# EAGLE design untitled (EAGLE 9.6.2)
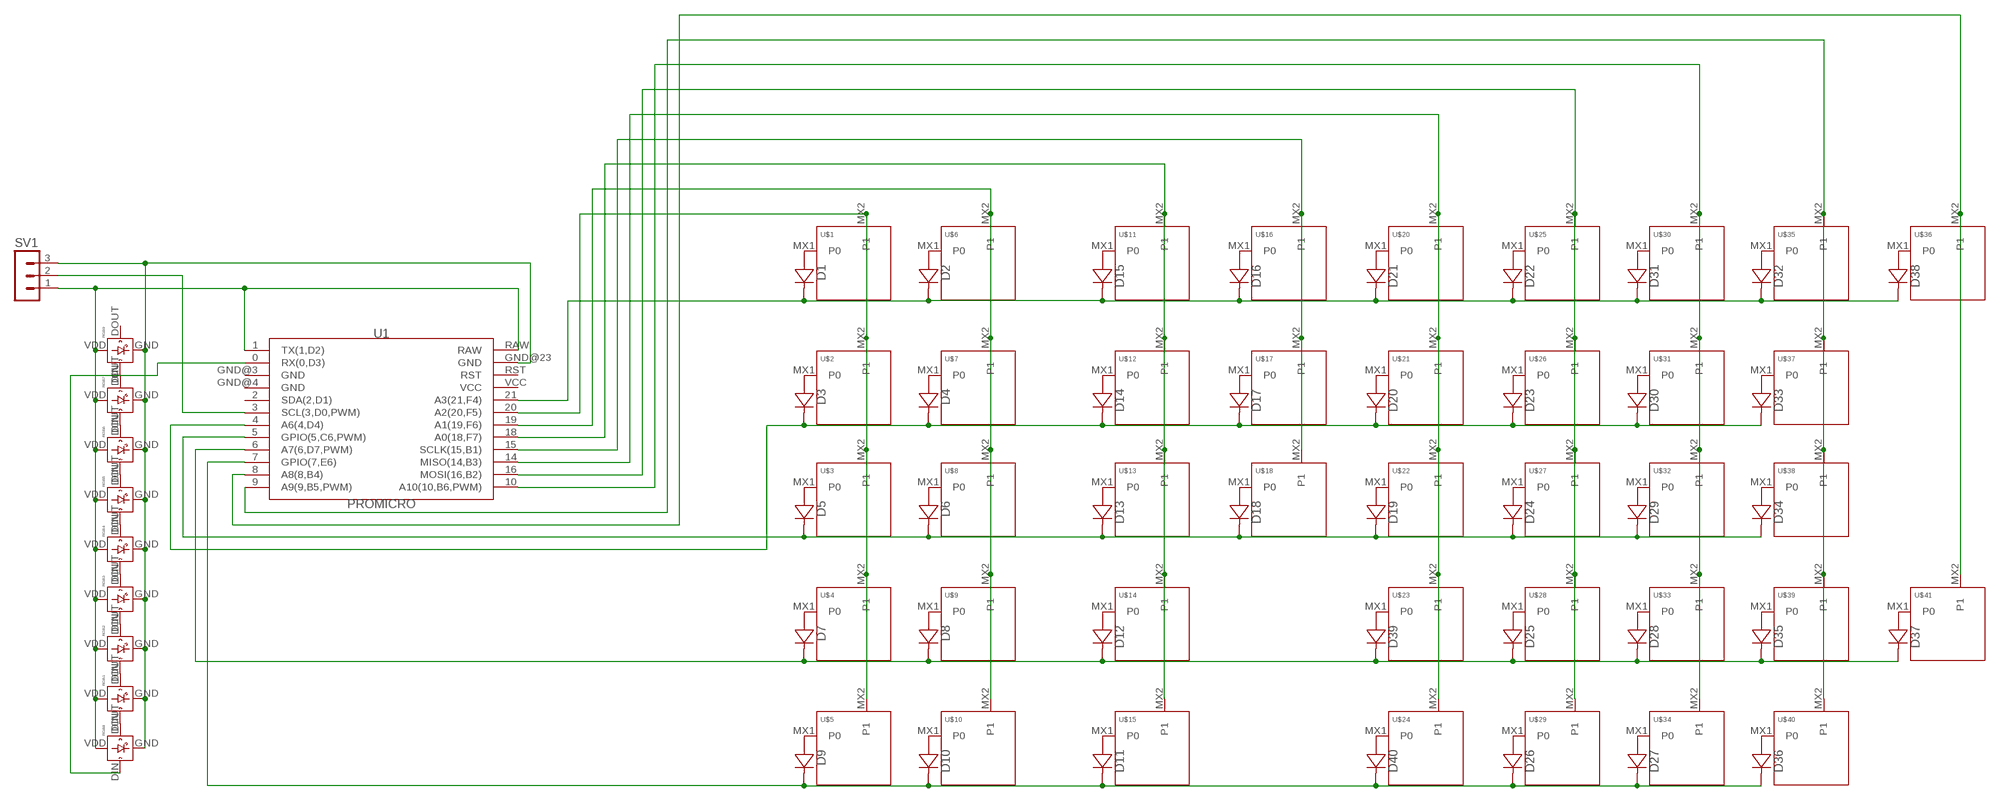
[diagram p0: schematic, sheet 1]

## Parts
D1  DIODE-SOD-123  [SOD-123]
D2  DIODE-SOD-123  [SOD-123]
D3  DIODE-SOD-123  [SOD-123]
D4  DIODE-SOD-123  [SOD-123]
D5  DIODE-SOD-123  [SOD-123]
D6  DIODE-SOD-123  [SOD-123]
D7  DIODE-SOD-123  [SOD-123]
D8  DIODE-SOD-123  [SOD-123]
D9  DIODE-SOD-123  [SOD-123]
D10  DIODE-SOD-123  [SOD-123]
D11  DIODE-SOD-123  [SOD-123]
D12  DIODE-SOD-123  [SOD-123]
D13  DIODE-SOD-123  [SOD-123]
D14  DIODE-SOD-123  [SOD-123]
D15  DIODE-SOD-123  [SOD-123]
D16  DIODE-SOD-123  [SOD-123]
D17  DIODE-SOD-123  [SOD-123]
D18  DIODE-SOD-123  [SOD-123]
D19  DIODE-SOD-123  [SOD-123]
D20  DIODE-SOD-123  [SOD-123]
D21  DIODE-SOD-123  [SOD-123]
D22  DIODE-SOD-123  [SOD-123]
D23  DIODE-SOD-123  [SOD-123]
D24  DIODE-SOD-123  [SOD-123]
D25  DIODE-SOD-123  [SOD-123]
D26  DIODE-SOD-123  [SOD-123]
D27  DIODE-SOD-123  [SOD-123]
D28  DIODE-SOD-123  [SOD-123]
D29  DIODE-SOD-123  [SOD-123]
D30  DIODE-SOD-123  [SOD-123]
D31  DIODE-SOD-123  [SOD-123]
D32  DIODE-SOD-123  [SOD-123]
D33  DIODE-SOD-123  [SOD-123]
D34  DIODE-SOD-123  [SOD-123]
D35  DIODE-SOD-123  [SOD-123]
D36  DIODE-SOD-123  [SOD-123]
D37  DIODE-SOD-123  [SOD-123]
D38  DIODE-SOD-123  [SOD-123]
D39  DIODE-SOD-123  [SOD-123]
D40  DIODE-SOD-123  [SOD-123]
RGB1  WS2812B-MINI  [WS2812B-MINI]
RGB2  WS2812B-MINI  [WS2812B-MINI]
RGB3  WS2812B-MINI  [WS2812B-MINI]
RGB4  WS2812B-MINI  [WS2812B-MINI]
RGB5  WS2812B-MINI  [WS2812B-MINI]
RGB6  WS2812B-MINI  [WS2812B-MINI]
RGB7  WS2812B-MINI  [WS2812B-MINI]
RGB8  WS2812B-MINI  [WS2812B-MINI]
RGB9  WS2812B-MINI  [WS2812B-MINI]
SV1  MA03-1  [MA03-1]
U1  PROMICRO  [PROMICRO]
U$1  KEYSWITCH-PLAIN-MX-1U  [MX-1U]
U$2  KEYSWITCH-PLAIN-MX-1U  [MX-1U]
U$3  KEYSWITCH-PLAIN-MX-1U  [MX-1U]
U$4  KEYSWITCH-PLAIN-MX-1U  [MX-1U]
U$5  KEYSWITCH-PLAIN-MX-1U  [MX-1U]
U$6  KEYSWITCH-PLAIN-MX-1U  [MX-1U]
U$7  KEYSWITCH-PLAIN-MX-1U  [MX-1U]
U$8  KEYSWITCH-PLAIN-MX-1U  [MX-1U]
U$9  KEYSWITCH-PLAIN-MX-1U  [MX-1U]
U$10  KEYSWITCH-PLAIN-MX-1U  [MX-1U]
U$11  KEYSWITCH-PLAIN-MX-1U  [MX-1U]
U$12  KEYSWITCH-PLAIN-MX-1U  [MX-1U]
U$13  KEYSWITCH-PLAIN-MX-1U  [MX-1U]
U$14  KEYSWITCH-PLAIN-MX-1U  [MX-1U]
U$15  KEYSWITCH-PLAIN-MX-1U  [MX-1U]
U$16  KEYSWITCH-PLAIN-MX-1U  [MX-1U]
U$17  KEYSWITCH-PLAIN-MX-1U  [MX-1U]
U$18  KEYSWITCH-PLAIN-MX-1U  [MX-1U]
U$20  KEYSWITCH-PLAIN-MX-1U  [MX-1U]
U$21  KEYSWITCH-PLAIN-MX-1U  [MX-1U]
U$22  KEYSWITCH-PLAIN-MX-1U  [MX-1U]
U$23  KEYSWITCH-PLAIN-MX-1U  [MX-1U]
U$24  KEYSWITCH-PLAIN-MX-1U  [MX-1U]
U$25  KEYSWITCH-PLAIN-MX-1U  [MX-1U]
U$26  KEYSWITCH-PLAIN-MX-1U  [MX-1U]
U$27  KEYSWITCH-PLAIN-MX-1U  [MX-1U]
U$28  KEYSWITCH-PLAIN-MX-1U  [MX-1U]
U$29  KEYSWITCH-PLAIN-MX-1U  [MX-1U]
U$30  KEYSWITCH-PLAIN-MX-1U  [MX-1U]
U$31  KEYSWITCH-PLAIN-MX-1U  [MX-1U]
U$32  KEYSWITCH-PLAIN-MX-1U  [MX-1U]
U$33  KEYSWITCH-PLAIN-MX-1U  [MX-1U]
U$34  KEYSWITCH-PLAIN-MX-1U  [MX-1U]
U$35  KEYSWITCH-PLAIN-MX-1U  [MX-1U]
U$36  KEYSWITCH-PLAIN-MX-1U  [MX-1U]
U$37  KEYSWITCH-PLAIN-MX-1U  [MX-1U]
U$38  KEYSWITCH-PLAIN-MX-1U  [MX-1U]
U$39  KEYSWITCH-PLAIN-MX-1U  [MX-1U]
U$40  KEYSWITCH-PLAIN-MX-1U  [MX-1U]
U$41  KEYSWITCH-PLAIN-MX-1U  [MX-1U]

## Nets
N$1: D1.A U$1.MX1(P0)
N$2: D2.A U$6.MX1(P0)
N$3: D3.A U$2.MX1(P0)
N$4: D4.A U$7.MX1(P0)
N$5: D5.A U$3.MX1(P0)
N$6: D6.A U$8.MX1(P0)
N$7: D7.A U$4.MX1(P0)
N$8: D8.A U$9.MX1(P0)
N$9: D9.A U$5.MX1(P0)
N$10: D10.A U$10.MX1(P0)
N$11: D11.A U$15.MX1(P0)
N$12: D12.A U$14.MX1(P0)
N$13: D13.A U$13.MX1(P0)
N$14: D14.A U$12.MX1(P0)
N$15: D15.A U$11.MX1(P0)
N$16: D16.A U$16.MX1(P0)
N$17: D17.A U$17.MX1(P0)
N$18: D18.A U$18.MX1(P0)
N$19: D19.A U$22.MX1(P0)
N$20: D20.A U$21.MX1(P0)
N$21: D21.A U$20.MX1(P0)
N$22: D22.A U$25.MX1(P0)
N$23: D23.A U$26.MX1(P0)
N$24: D24.A U$27.MX1(P0)
N$25: D25.A U$28.MX1(P0)
N$26: D26.A U$29.MX1(P0)
N$27: D27.A U$34.MX1(P0)
N$28: D28.A U$33.MX1(P0)
N$29: D29.A U$32.MX1(P0)
N$30: D30.A U$31.MX1(P0)
N$31: D31.A U$30.MX1(P0)
N$32: D32.A U$35.MX1(P0)
N$33: D33.A U$37.MX1(P0)
N$34: D34.A U$38.MX1(P0)
N$35: D35.A U$39.MX1(P0)
N$36: D36.A U$40.MX1(P0)
N$37: D37.A U$41.MX1(P0)
N$38: D38.A U$36.MX1(P0)
N$39: D1.C D2.C D15.C D16.C D21.C D22.C D31.C D32.C D38.C U1.21(A3(21,F4))
N$41: D5.C D6.C D13.C D18.C D19.C D24.C D29.C D34.C U1.5(GPIO(5,C6,PWM))
N$42: D7.C D8.C D12.C D25.C D28.C D35.C D37.C D39.C U1.6(A7(6,D7,PWM))
N$43: D39.A U$23.MX1(P0)
N$44: D40.A U$24.MX1(P0)
N$45: D9.C D10.C D11.C D26.C D27.C D36.C D40.C U1.7(GPIO(7,E6))
N$46: U1.20(A2(20,F5)) U$1.MX2(P1) U$2.MX2(P1) U$3.MX2(P1) U$4.MX2(P1) U$5.MX2(P1)
N$47: U1.19(A1(19,F6)) U$6.MX2(P1) U$7.MX2(P1) U$8.MX2(P1) U$9.MX2(P1) U$10.MX2(P1)
N$48: U1.18(A0(18,F7)) U$11.MX2(P1) U$12.MX2(P1) U$13.MX2(P1) U$14.MX2(P1) U$15.MX2(P1)
N$49: U1.15(SCLK(15,B1)) U$16.MX2(P1) U$17.MX2(P1) U$18.MX2(P1)
N$50: U1.14(MISO(14,B3)) U$20.MX2(P1) U$21.MX2(P1) U$22.MX2(P1) U$23.MX2(P1) U$24.MX2(P1)
N$51: U1.16(MOSI(16,B2)) U$25.MX2(P1) U$26.MX2(P1) U$27.MX2(P1) U$28.MX2(P1) U$29.MX2(P1)
N$52: U1.10(A10(10,B6,PWM)) U$30.MX2(P1) U$31.MX2(P1) U$32.MX2(P1) U$33.MX2(P1) U$34.MX2(P1)
N$53: U1.9(A9(9,B5,PWM)) U$35.MX2(P1) U$37.MX2(P1) U$38.MX2(P1) U$39.MX2(P1) U$40.MX2(P1)
N$54: U1.8(A8(8,B4)) U$36.MX2(P1) U$41.MX2(P1)
N$55: RGB1.DOUT RGB2.DIN
N$56: RGB2.DOUT RGB3.DIN
N$57: RGB3.DOUT RGB4.DIN
N$58: RGB4.DOUT RGB5.DIN
N$59: RGB5.DOUT RGB6.DIN
N$60: RGB6.DOUT RGB7.DIN
N$61: RGB1.DIN RGB8.DOUT
N$62: RGB7.DOUT RGB9.DIN
N$63: RGB1.VDD RGB2.VDD RGB3.VDD RGB4.VDD RGB5.VDD RGB6.VDD RGB7.VDD RGB8.VDD RGB9.VDD SV1.1 U1.1(TX(1,D2)) U1.RAW
N$64: RGB1.GND RGB2.GND RGB3.GND RGB4.GND RGB5.GND RGB6.GND RGB7.GND RGB8.GND RGB9.GND SV1.3 U1.GND@23(GND)
N$65: RGB8.DIN U1.0(RX(0,D3))
N$66: D3.C D4.C D14.C D17.C D20.C D23.C D30.C D33.C U1.4(A6(4,D4))
N$67: SV1.2 U1.3(SCL(3,D0,PWM))
Unconnected: RGB9.DOUT U1.2(SDA(2,D1)) U1.GND@3(GND) U1.GND@4(GND) U1.RST U1.VCC

## Library data of the parts
D1-D40 = Controller:DIODE: Standard 1N4148 diode
RGB1-RGB9 = LED:WS2812B
SV1 = con-lstb:MA03-1: PIN HEADER; OC_FARNELL: unknown; OC_NEWARK: unknown
U1 = Controller:PROMICRO
U$1-U$18 U$20-U$41 = Keyboard:KEYSWITCH-PLAIN

## Board
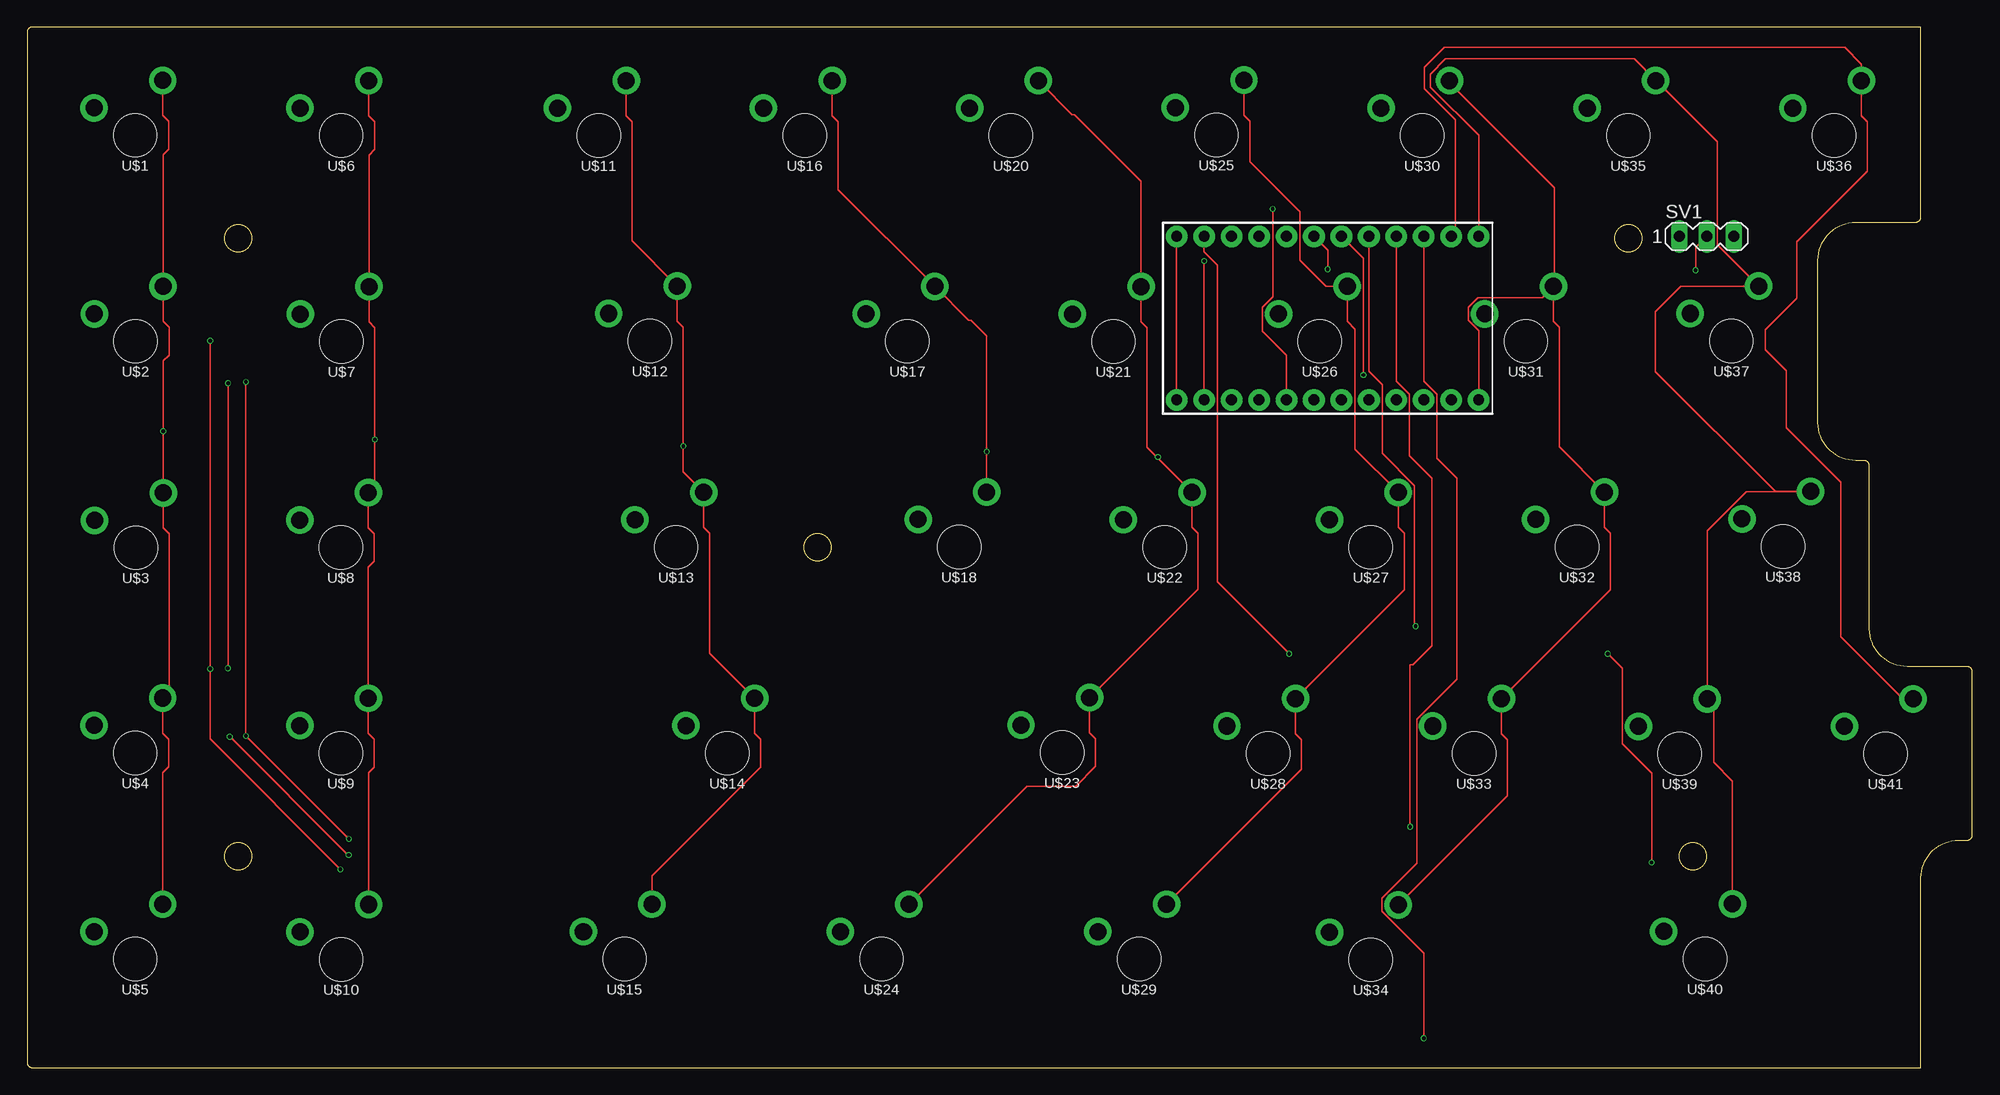
[diagram p1: board, top side]
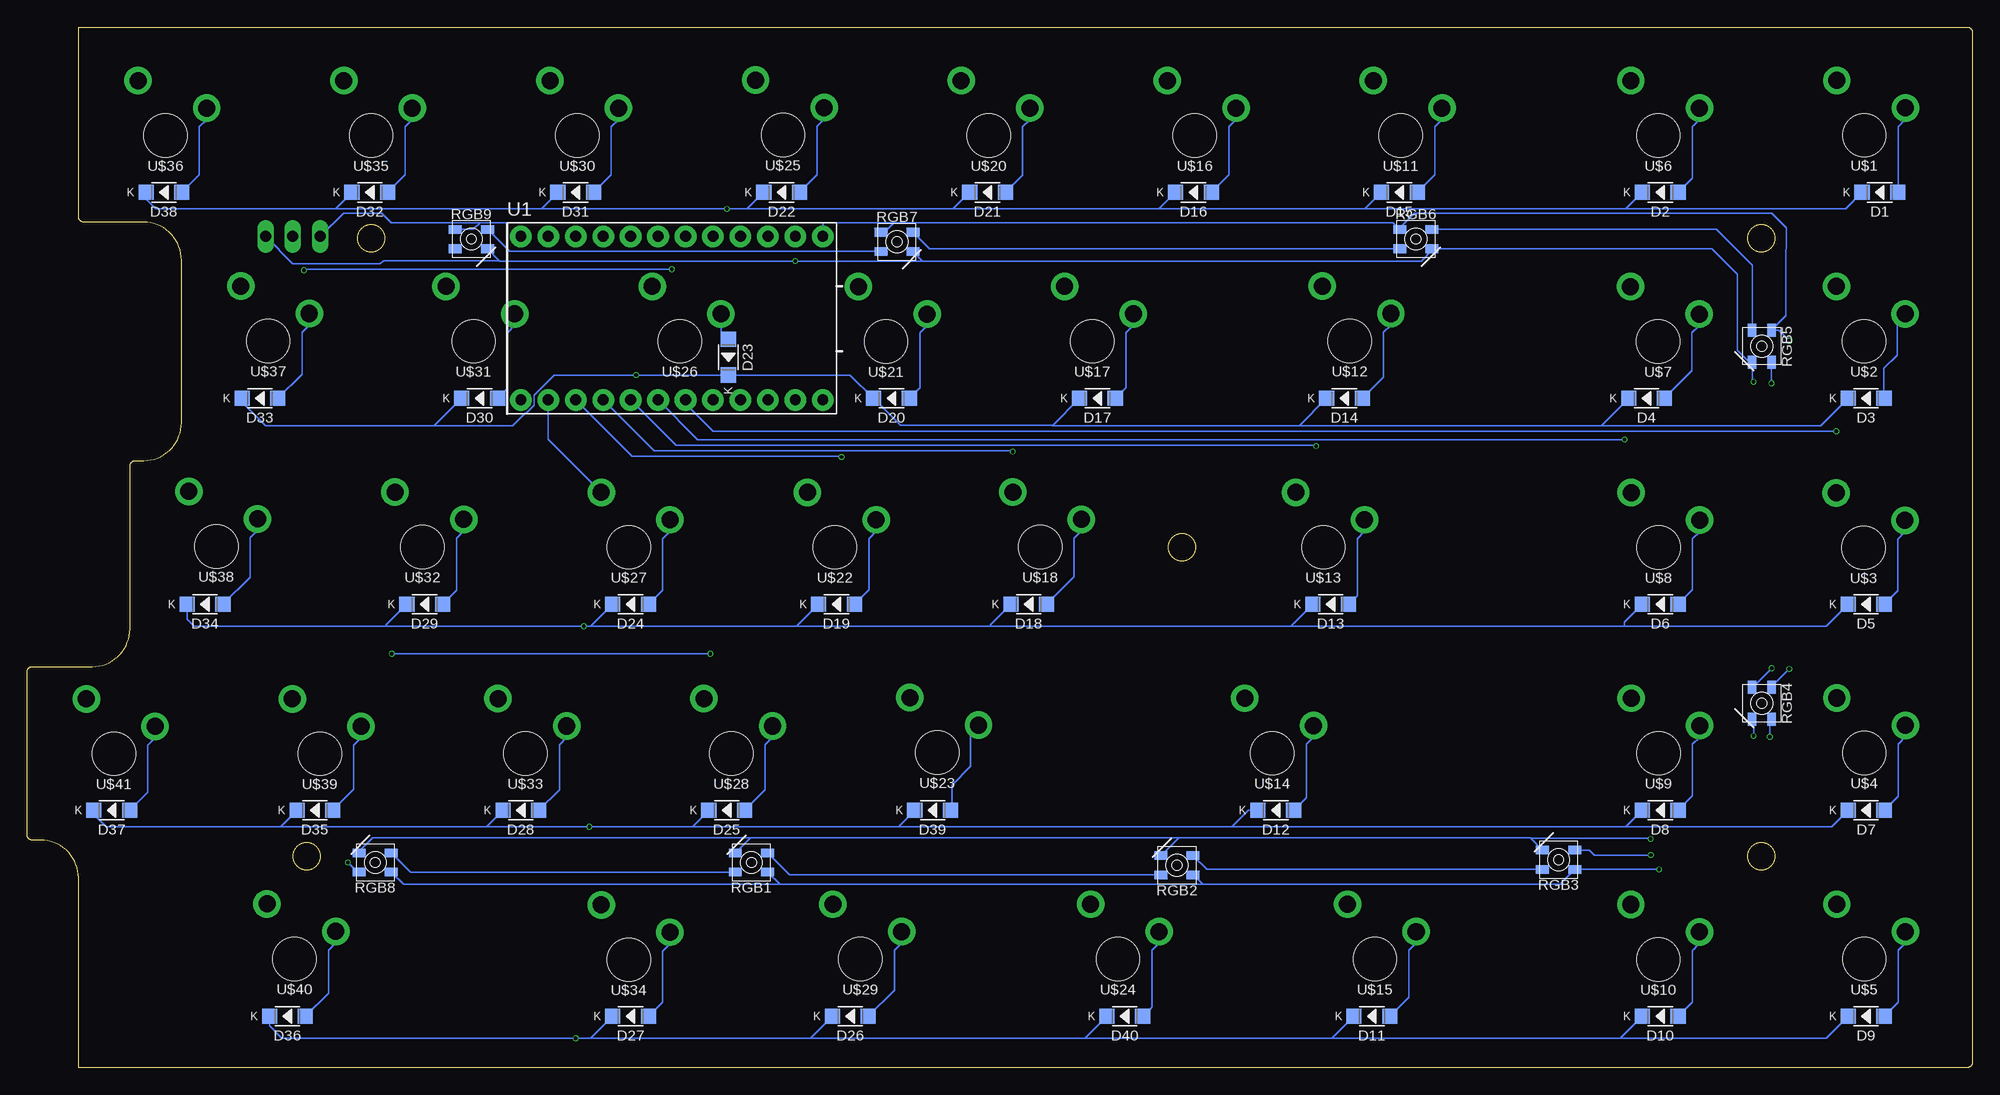
[diagram p2: board, bottom side, seen from below]

Size 179.98 x 96.25 mm. Coordinates in mm from the lower left corner, seen from the top.
Outline: 175.21,17.55 arc-90 178.71,21.05 179.48,21.05 arc90 179.98,21.55 179.98,36.6 arc90 179.48,37.1 173.95,37.1 arc-90 170.45,40.6 170.45,55.65 arc90 169.95,56.15 169.19,56.15 arc-90 165.69,59.65 165.69,74.7 arc-90 169.19,78.2 174.71,78.2 arc90 175.21,78.7 175.21,96.25 0.53,96.25 0.46,96.25 0.43,96.24 0.38,96.23 0.34,96.22 0.31,96.21 0.27,96.19 0.24,96.18 0.21,96.15 0.17,96.13 0.15,96.1 0.12,96.08 0.1,96.04 0.07,96.01 0.06,95.98 0.04,95.94 0.03,95.91 0.02,95.87 0.01,95.83 0,95.79 0,95.72 0,0.53 0,0.46 0.01,0.42 0.02,0.38 0.03,0.34 0.04,0.31 0.06,0.27 0.07,0.24 0.1,0.2 0.12,0.17 0.15,0.15 0.17,0.12 0.21,0.1 0.24,0.07 0.27,0.05 0.31,0.04 0.35,0.02 0.38,0.01 0.42,0.01 0.46,0 0.53,0 175.21,0 175.21,17.55
Outline: circle at 154.09,19.55 radius 1.25
Outline: circle at 148.14,76.7 radius 1.25
Outline: circle at 73.13,48.12 radius 1.25
Outline: circle at 19.55,19.55 radius 1.25
Outline: circle at 19.55,76.7 radius 1.25
Copper layers (1*16): Top 0.035559375mm / dielectric 1.6mm / Bottom 0.035559375mm
Design rules "jlcpcb2layer": minimum track width 5mil, minimum drill 12mil, track to track 5mil, track to pad 5mil, pad to pad 5mil, via to via 5mil, smd to smd 5mil, copper to edge 8mil, drill to drill 6mil, minimum pad ring 5mil, minimum via ring 3mil, stop-mask expansion 2.5mil, vias tented up to drill 0mil, thermal gap 10mil

### Footprints (pad centres in the part's own frame; a part is rotated, then mirrored left to right if it is on the bottom)
SOD-123 = smd 1.397 x 1.397: A -1.651,0; C 1.651,0
WS2812B-MINI = smd 0.8 x 1.2: DIN 0.89,-1.49; DOUT -0.89,1.49; GND -0.89,-1.49; VDD 0.89,1.49
MA03-1 = drill 1.016 long: 1 -2.54,0; 2 0,0; 3 2.54,0
PROMICRO = drill 1 pad 2: 0 -7.62,11.43; 1 -7.62,13.97; 2 -7.62,3.81; 3 -7.62,1.27; 4 -7.62,-1.27; 5 -7.62,-3.81; 6 -7.62,-6.35; 7 -7.62,-8.89; 8 -7.62,-11.43; 9 -7.62,-13.97; 10 7.5,-13.97; 14 7.5,-8.89; 15 7.5,-6.35; 16 7.5,-11.43; 18 7.5,-3.81; 19 7.5,-1.27; 20 7.5,1.27; 21 7.5,3.81; GND@3 -7.62,8.89; GND@4 -7.62,6.35; GND@23 7.5,11.43; RAW 7.5,13.97; RST 7.5,8.89; VCC 7.5,6.35
MX-1U = drill 1.575 pad 2.54: MX1 -3.81,2.54; MX2 2.54,5.08 | hole 4: 0,0

### Placement (x,y rotation side)
D1  8.57,80.96 180 bottom
D2  28.89,80.96 180 bottom
D3  9.84,61.91 180 bottom
D4  30.16,61.91 180 bottom
D5  9.84,42.86 180 bottom
D6  28.89,42.86 180 bottom
D7  9.84,23.81 180 bottom
D8  28.89,23.81 180 bottom
D9  9.84,4.76 180 bottom
D10  28.89,4.76 180 bottom
D11  55.56,4.76 180 bottom
D12  64.45,23.81 180 bottom
D13  59.37,42.86 180 bottom
D14  58.1,61.91 180 bottom
D15  53.02,80.96 180 bottom
D16  72.07,80.96 180 bottom
D17  80.96,61.91 180 bottom
D18  87.31,42.86 180 bottom
D19  105.09,42.86 180 bottom
D20  100.01,61.91 180 bottom
D21  91.12,80.96 180 bottom
D22  110.17,80.96 180 bottom
D23  115.09,65.72 270 bottom
D24  124.14,42.86 180 bottom
D25  115.25,23.81 180 bottom
D26  103.82,4.76 180 bottom
D27  124.14,4.76 180 bottom
D28  134.3,23.81 180 bottom
D29  143.19,42.86 180 bottom
D30  138.11,61.91 180 bottom
D31  129.22,80.96 180 bottom
D32  148.27,80.96 180 bottom
D33  158.43,61.91 180 bottom
D34  163.51,42.86 180 bottom
D35  153.35,23.81 180 bottom
D36  155.89,4.76 180 bottom
D37  172.14,23.81 180 bottom
D38  167.32,80.96 180 bottom
D39  96.2,23.81 180 bottom
D40  78.42,4.76 180 bottom
RGB1  112.96,18.98 270 bottom
RGB2  73.59,18.73 270 bottom
RGB3  38.28,19.23 270 bottom
RGB4  19.49,33.71 0 bottom
RGB5  19.49,66.73 0 bottom
RGB6  51.49,76.64 90 bottom
RGB7  99.5,76.38 90 bottom
RGB8  147.76,18.98 270 bottom
RGB9  138.87,76.64 90 bottom
SV1  155.38,76.89 0 top
U1  120.33,69.27 270 bottom
U$1  10.01,86.24 0 top
U$2  10.04,67.19 0 top
U$3  10.06,48.09 0 top
U$4  10.01,29.11 0 top
U$5  10.01,10.04 0 top
U$6  29.06,86.21 0 top
U$7  29.09,67.16 0 top
U$8  29.04,48.11 0 top
U$9  29.04,29.09 0 top
U$10  29.06,10.01 0 top
U$11  52.89,86.21 0 top
U$12  57.61,67.21 0 top
U$13  60.05,48.14 0 top
U$14  64.78,29.09 0 top
U$15  55.28,10.04 0 top
U$16  71.94,86.21 0 top
U$17  81.44,67.19 0 top
U$18  86.24,48.16 0 top
U$20  91.01,86.21 0 top
U$21  100.51,67.16 0 top
U$22  105.24,48.14 0 top
U$23  95.76,29.14 0 top
U$24  79.05,10.04 0 top
U$25  110.04,86.26 0 top
U$26  119.59,67.19 0 top
U$27  124.31,48.14 0 top
U$28  114.81,29.06 0 top
U$29  102.88,10.04 0 top
U$30  129.06,86.21 0 top
U$31  138.67,67.19 0 top
U$32  143.39,48.16 0 top
U$33  133.86,29.06 0 top
U$34  124.31,9.99 0 top
U$35  148.14,86.21 0 top
U$36  167.16,86.21 0 top
U$37  157.66,67.21 0 top
U$38  162.46,48.22 0 top
U$39  152.89,29.04 0 top
U$40  155.23,10.06 0 top
U$41  171.94,29.04 0 top

### Tracks (layer width: path | path; a pad name or v marks a point on that pad's centre or on a via)
N$1
  Bottom 0.152: U$1.MX1 6.2,87.72 6.88,87.04 6.88,81 D1.A
N$2
  Bottom 0.152: U$6.MX1 25.25,87.69 25.93,87.02 25.93,82.27 D2.A
N$3
  Bottom 0.152: D3.A 8.19,64.67 6.95,65.91 6.95,69.01 U$2.MX1
N$4
  Bottom 0.152: U$7.MX1 25.28,68.64 25.95,67.97 25.95,64.46 D4.A
N$5
  Bottom 0.152: U$3.MX1 6.26,49.57 6.93,48.89 6.93,44.11 D5.A
N$6
  Bottom 0.152: U$8.MX1 25.23,49.59 25.9,48.92 25.9,44.19 D6.A
N$7
  Bottom 0.152: U$4.MX1 6.2,30.59 6.88,29.92 6.88,25.12 D7.A
N$8
  Bottom 0.152: U$9.MX1 25.23,30.57 25.9,29.89 25.9,25.14 D8.A
N$9
  Bottom 0.152: U$5.MX1 6.2,11.52 6.88,10.84 6.88,6.07 D9.A
N$10
  Bottom 0.152: U$10.MX1 25.25,11.49 25.93,10.82 25.93,6.07 D10.A
N$11
  Bottom 0.152: U$15.MX1 51.47,11.52 52.14,10.84 52.14,6.52 D11.A
N$12
  Bottom 0.152: U$14.MX1 60.97,30.57 61.64,29.89 61.64,24.96 D12.A
N$13
  Bottom 0.152: U$13.MX1 56.24,49.62 56.91,48.94 56.91,43.66 D13.A
N$14
  Bottom 0.152: U$12.MX1 53.8,68.69 54.48,68.02 54.48,63.88 D14.A
N$15
  Bottom 0.152: U$11.MX1 49.08,87.69 49.75,87.02 49.75,82.57 D15.A
N$16
  Bottom 0.152: U$16.MX1 68.13,87.69 68.8,87.02 68.8,82.57 D16.A
N$17
  Bottom 0.152: U$17.MX1 77.63,68.67 78.3,67.99 78.3,62.91 D17.A
N$18
  Bottom 0.152: U$18.MX1 82.43,49.64 83.1,48.97 83.1,45.41 D18.A
N$19
  Bottom 0.152: U$22.MX1 101.43,49.62 102.1,48.94 102.1,44.19 D19.A
N$20
  Bottom 0.152: U$21.MX1 96.7,68.64 97.38,67.97 97.38,62.89 D20.A
N$21
  Bottom 0.152: U$20.MX1 87.2,87.69 87.88,87.02 87.88,82.54 D21.A
N$22
  Bottom 0.152: U$25.MX1 106.23,87.74 106.9,87.07 106.9,82.57 D22.A
N$23
  Bottom 0.152: U$26.MX1 115.78,68.05 D23.A
N$24
  Bottom 0.152: U$27.MX1 120.5,49.62 121.18,48.94 121.18,44.17 D24.A
N$25
  Bottom 0.152: U$28.MX1 111,30.54 111.68,29.87 111.68,25.73 D25.A
N$26
  Bottom 0.152: U$29.MX1 99.07,11.52 99.74,10.84 99.74,7.18 D26.A
N$27
  Bottom 0.152: U$34.MX1 120.5,11.47 121.18,10.79 121.18,6.07 D27.A
N$28
  Bottom 0.152: U$33.MX1 130.05,30.54 130.73,29.87 130.73,25.73 D28.A
N$29
  Bottom 0.152: U$32.MX1 139.58,49.64 140.25,48.97 140.25,44.14 D29.A
N$30
  Bottom 0.152: U$31.MX1 134.86,68.67 135.53,67.99 135.53,62.83 D30.A
N$31
  Bottom 0.152: U$30.MX1 125.25,87.69 125.93,87.02 125.93,82.6 D31.A
N$32
  Bottom 0.152: U$35.MX1 144.33,87.69 145,87.02 145,82.57 D32.A
N$33
  Bottom 0.152: U$37.MX1 153.85,68.69 154.53,68.02 154.53,64.16 D33.A
N$34
  Bottom 0.152: U$38.MX1 158.66,49.69 159.33,49.02 159.33,45.38 D34.A
N$35
  Bottom 0.152: U$39.MX1 149.08,30.52 149.75,29.84 149.75,25.75 D35.A
N$36
  Bottom 0.152: U$40.MX1 151.42,11.54 152.09,10.87 152.09,6.9 D36.A
N$37
  Bottom 0.152: U$41.MX1 168.13,30.52 168.8,29.84 168.8,25.5 D37.A
N$38
  Bottom 0.152: U$36.MX1 163.35,87.69 164.03,87.02 164.03,82.6 D38.A
N$39  (via drill 0.35)
  Top 0.152: U1.21 116.52,65.89 114.28,68.13 114.28,70.35 115.25,71.32 v115.25,79.43
  Bottom 0.152: D1.C 11.74,79.43 32.06,79.43 | 32.06,79.43 56.19,79.43 | 56.19,79.43 75.24,79.43 | 75.24,79.43 94.29,79.43 | 94.29,79.43 113.34,79.43 | 113.34,79.43 v115.25,79.43 132.39,79.43 | 132.39,79.43 151.44,79.43 | 151.44,79.43 168.08,79.43 168.97,80.32 D38.C | D2.C 32.06,79.43 | D15.C 56.19,79.43 | D16.C 75.24,79.43 | D21.C 94.29,79.43 | D22.C 113.34,79.43 | D31.C 132.39,79.43 | D32.C 151.44,79.43
N$41  (via drill 0.35)
  Top 0.152: U1.5 124.14,64.42 125.37,63.19 125.37,56.83 128.35,53.84 128.35,40.93 v128.45,40.82
  Bottom 0.152: D5.C 13.52,40.82 32.19,40.82 | 63.05,40.82 90.86,40.82 | 90.86,40.82 108.77,40.82 | 108.77,40.82 127.82,40.82 | 127.82,40.82 v128.45,40.82 146.74,40.82 | 146.74,40.82 164.52,40.82 165.16,41.46 D34.C | D6.C 32.19,41.21 32.19,40.82 | D13.C 63.05,40.82 | D18.C 90.86,40.95 90.86,40.82 | D19.C 108.77,40.82 | D24.C 127.82,40.82 | D29.C 146.74,40.95 146.74,40.82 | 32.19,40.82 63.05,40.82
N$42  (via drill 0.35)
  Top 0.152: U1.6 126.68,63.51 127.91,62.28 127.91,56.61 129.98,54.54 129.98,39.05 128.2,37.27 127.95,37.27 v127.95,22.28
  Bottom 0.152: D7.C 13.01,22.28 32.06,22.28 | 32.06,22.28 68.51,22.28 | 68.51,22.28 99.37,22.28 | 99.37,22.28 118.42,22.28 | 118.42,22.28 v127.95,22.28 137.47,22.28 | 137.47,22.28 156.52,22.28 | 156.52,22.28 172.65,22.28 173.79,23.43 D37.C | D35.C 156.52,22.28 | D28.C 137.47,22.28 | D25.C 118.42,22.28 | D39.C 99.37,22.28 | D12.C 66.99,23.81 68.51,22.28 | D8.C 32.06,22.28
N$43
  Bottom 0.152: U$23.MX1 92.67,30.96 92.67,27.86 94.42,26.11 94.42,23.3 94.55,23.43 D39.A
N$44
  Bottom 0.152: U$24.MX1 75.24,11.52 75.91,10.84 75.91,5.61 D40.A
N$45  (via drill 0.35)
  Top 0.152: U1.7 129.22,63.51 130.45,62.28 130.45,56.36 132.26,54.54 132.26,35.93 128.56,32.23 128.56,18.89 125.36,15.69 125.36,14.45 129.22,10.59 v129.22,2.72
  Bottom 0.152: D9.C 13.52,2.72 32.57,2.72 | 32.57,2.72 59.24,2.72 | 59.24,2.72 82.1,2.72 | 82.1,2.72 107.5,2.72 | 107.5,2.72 127.82,2.72 | D36.C 157.54,3.87 156.39,2.72 v129.22,2.72 127.82,2.72 | D10.C 32.57,2.72 | D11.C 59.24,2.72 | D40.C 82.1,2.72 | D26.C 107.5,2.72 | D27.C 127.82,2.72
N$46  (via drill 0.35)
  Top 0.152: U$1.MX2 12.55,88.07 13.11,87.52 13.11,84.96 12.58,84.43 U$2.MX2 12.58,69.02 13.13,68.47 13.13,65.91 12.61,65.38 v12.61,58.86 U$3.MX2 12.61,49.92 13.16,49.37 13.16,34.8 U$4.MX2 12.55,30.95 13.11,30.4 13.11,27.83 12.55,27.28 U$5.MX2
  Bottom 0.152: U1.20 119.06,61.4 116.52,58.86 v12.61,58.86
N$47  (via drill 0.35)
  Top 0.152: U$6.MX2 31.6,88.05 32.16,87.5 32.16,84.93 31.63,84.41 U$7.MX2 31.63,69 32.18,68.45 v32.18,58.1 32.18,53.8 U$8.MX2 31.58,49.95 32.13,49.4 32.13,46.83 31.58,46.28 U$9.MX2 31.58,30.92 32.13,30.37 32.13,27.81 31.6,27.28 U$10.MX2
  Bottom 0.152: U1.19 117.92,58.1 v32.18,58.1
N$48  (via drill 0.35)
  Top 0.152: U$11.MX2 55.43,88.05 55.98,87.5 55.98,76.47 U$12.MX2 60.15,69.05 60.71,68.5 v60.71,57.49 60.71,55.11 U$13.MX2 62.59,49.97 63.14,49.42 63.14,38.34 U$14.MX2 67.32,30.92 67.87,30.37 67.87,27.81 57.82,17.76 U$15.MX2
  Bottom 0.152: U1.18 119.95,57.59 60.64,57.59 60.64,57.56 v60.71,57.49
N$49  (via drill 0.35)
  Top 0.152: U$16.MX2 74.48,88.05 75.03,87.5 75.03,81.22 U$17.MX2 87.12,69.13 87.32,69.13 88.78,67.68 v88.78,56.98 U$18.MX2
  Bottom 0.152: U1.15 121.98,57.08 88.83,57.08 88.78,57.03 v88.78,56.98
N$50  (via drill 0.35)
  Top 0.152: U$20.MX2 96.69,88.16 96.9,88.16 103.05,82 U$21.MX2 103.05,69 103.61,68.45 103.61,57.39 104.63,56.37 | 104.63,56.37 U$22.MX2 107.78,49.97 108.33,49.42 108.33,44.25 U$23.MX2 98.3,30.97 98.86,30.42 98.86,27.86 97.05,26.05 92.52,26.05 U$24.MX2 | v104.63,56.47 104.63,56.37
  Bottom 0.152: U1.14 124.02,56.57 104.53,56.57 v104.63,56.47
N$51
  Top 0.152: U$25.MX2 112.58,88.1 113.13,87.55 113.13,83.79 117.75,79.18 117.75,74.67 120.15,72.27 U$26.MX2 122.13,69.02 122.86,68.29 122.86,57.21 U$27.MX2 126.85,49.97 127.41,49.42 127.41,44.2 U$28.MX2 117.35,30.9 117.91,30.35 117.91,27.61 U$29.MX2
  Bottom 0.152: U1.16 131.76,58.12 U$27.MX2
N$52
  Top 0.152: U$30.MX2 131.6,91.1 141.3,81.4 141.3,72.36 U$31.MX2 | U$31.MX2 141.21,69.02 141.76,68.47 141.76,57.42 U$32.MX2 145.93,50 146.48,49.45 146.48,44.22 U$33.MX2 136.4,30.9 136.96,30.35 136.96,25.17 U$34.MX2 | U$31.MX2 140.16,71.23 134.23,71.23 133.36,70.35 133.36,69.11 134.3,68.17 U1.10
N$53
  Top 0.152: U$40.MX2 157.77,26.5 156.03,28.23 156.03,33.52 U$39.MX2 155.44,34.13 155.44,49.66 159.05,53.27 164.98,53.27 U$38.MX2 161.73,53.3 150.64,64.38 150.64,69.93 152.98,72.27 160.18,72.27 U$37.MX2 156.37,76.13 156.37,85.66 150.73,91.29 U$35.MX2 148.67,93.3 131.24,93.3 129.83,91.89 129.83,90.7 134.3,86.23 U1.9
N$54
  Top 0.152: U$41.MX2 173.51,34.12 167.77,39.86 167.77,54.17 162.74,59.2 162.74,64.47 160.8,66.41 160.8,68.23 163.74,71.17 163.74,76.38 170.26,82.9 170.26,87.5 169.7,88.05 U$36.MX2 169.7,92.82 168.15,94.37 131.11,94.37 129.29,92.55 129.29,90.55 132.16,87.68 132.16,77.29 U1.8
N$55
  Bottom 0.152: RGB2.DIN 109.44,17.84 RGB1.DOUT
N$56
  Bottom 0.152: RGB3.DIN 70.83,18.34 RGB2.DOUT
N$57  (via drill 0.35)
  Top 0.152: v29.75,19.67 29.72,19.67 18.78,30.61 v18.75,30.61
  Bottom 0.152: RGB4.DIN 18.73,32.09 18.73,30.59 v18.75,30.61 | RGB3.DOUT 35.46,20.12 34.98,19.64 29.77,19.64 v29.75,19.67
N$58  (via drill 0.35)
  Top 0.152: v18.6,63.3 18.6,36.96 v18.58,36.94
  Bottom 0.152: RGB5.DIN 18.6,63.56 18.73,63.43 v18.6,63.3 | RGB4.DOUT 20.31,35.2 v18.58,36.94
N$59
  Bottom 0.152: RGB6.DIN 23.69,77.53 20.38,74.21 RGB5.DOUT
N$60
  Bottom 0.152: RGB6.DOUT 96.48,75.75 RGB7.DIN
N$61
  Bottom 0.152: RGB1.DIN 144.49,18.09 RGB8.DOUT
N$62
  Bottom 0.152: RGB7.DOUT 135.34,75.49 RGB9.DIN
N$63  (via drill 0.35)
  Top 0.152: v28.99,18.35 28.99,18.37 16.95,30.41 v16.95,36.89 v16.95,67.24 | U1.1 U1.RAW
  Bottom 0.152: 71.21,16.95 38.03,16.95 38.03,17.11 RGB3.VDD v28.99,18.35 | 71.21,16.95 110.33,16.95 | 110.33,16.95 145.13,16.95 RGB8.VDD | RGB1.VDD 110.33,16.95 | RGB2.VDD 71.21,16.95 | RGB9.VDD 138.7,77.53 138.07,78.16 | 106.36,78.16 138.07,78.16 | 106.36,78.16 99.75,78.16 | 99.75,78.16 54.04,78.16 54.03,78.16 53.62,78.16 53.57,78.12 53.06,77.61 | 53.06,77.61 RGB6.VDD | RGB7.VDD 100.64,77.27 99.75,78.16 | v16.95,36.89 18.6,35.24 RGB4.VDD | 53.06,77.61 51.63,79.04 18.58,79.04 17.21,77.67 17.21,75.73 17.28,75.66 17.28,69.54 RGB5.VDD 17.93,68.22 v16.95,67.24 | U1.1 106.36,78.16 | 138.07,78.16 146.27,78.16 147.16,79.04 150.69,79.04 SV1.1
N$64  (via drill 0.35)
  Top 0.152: v20.25,63.43 v20.25,30.69 v29.78,21.16 | U1.GND@23 v108.9,74.61
  Bottom 0.152: RGB3.GND 40.87,21.22 | 40.87,21.22 40.92,21.27 73.43,21.27 | 73.43,21.27 113.05,21.27 | 113.05,21.27 148.01,21.27 149.25,20.03 RGB8.GND | RGB1.GND 113.05,21.27 | RGB2.GND 73.43,21.27 | RGB9.GND 136.28,74.65 | 136.28,74.65 136.24,74.61 v108.9,74.61 97.12,74.61 | 97.12,74.61 50.98,74.61 50,75.59 RGB6.GND 24.12,75.75 21.75,73.37 21.75,66.36 20.63,65.24 RGB5.GND 20.38,63.56 v20.25,63.43 | RGB7.GND 97.12,74.61 | v20.25,30.69 20.25,32.09 RGB4.GND | v29.78,21.16 29.83,21.22 40.87,21.22 | 136.28,74.65 147,74.65 147.29,74.36 155.38,74.36 SV1.3
N$65  (via drill 0.35)
  Top 0.152: U1.0 108.9,75.46 110.13,74.24 110.13,44.93 v116.77,38.28 | v150.3,18.98 150.3,27.26 147.58,29.97 147.58,36.94 v146.23,38.28
  Bottom 0.152: v116.77,38.28 v146.23,38.28 | v150.3,18.98 149.41,18.09 RGB8.DIN
N$66  (via drill 0.35)
  Top 0.152: U1.4 123.63,74.86 v123.63,64.07
  Bottom 0.152: D3.C 14.03,59.37 34.35,59.37 | 62.29,59.37 85.15,59.37 85.08,59.43 | 142.3,59.37 157.92,59.37 160.08,61.53 D33.C | D4.C 34.35,59.37 | D14.C 62.29,59.37 | D17.C 85.08,59.43 | D30.C 142.3,59.37 | 34.35,59.37 62.29,59.37 | 85.08,59.43 99.18,59.43 D20.C 103.82,64.07 D23.C v123.63,64.07 131.2,64.07 133.07,62.2 133.07,61.26 133.79,60.54 133.88,60.54 135.06,59.37 142.3,59.37
N$67  (via drill 0.35)
  Top 0.152: U1.3 120.33,75.62 v120.33,73.84 | v154.36,73.75 154.36,75.88 SV1.2
  Bottom 0.152: v120.33,73.84 154.36,73.84 v154.36,73.75